# Altium schematic sheet Power.SchDoc: = Title
size 431 x 279 mm; Revision: v1.0; SheetNumber: 2; SheetTotal: 7
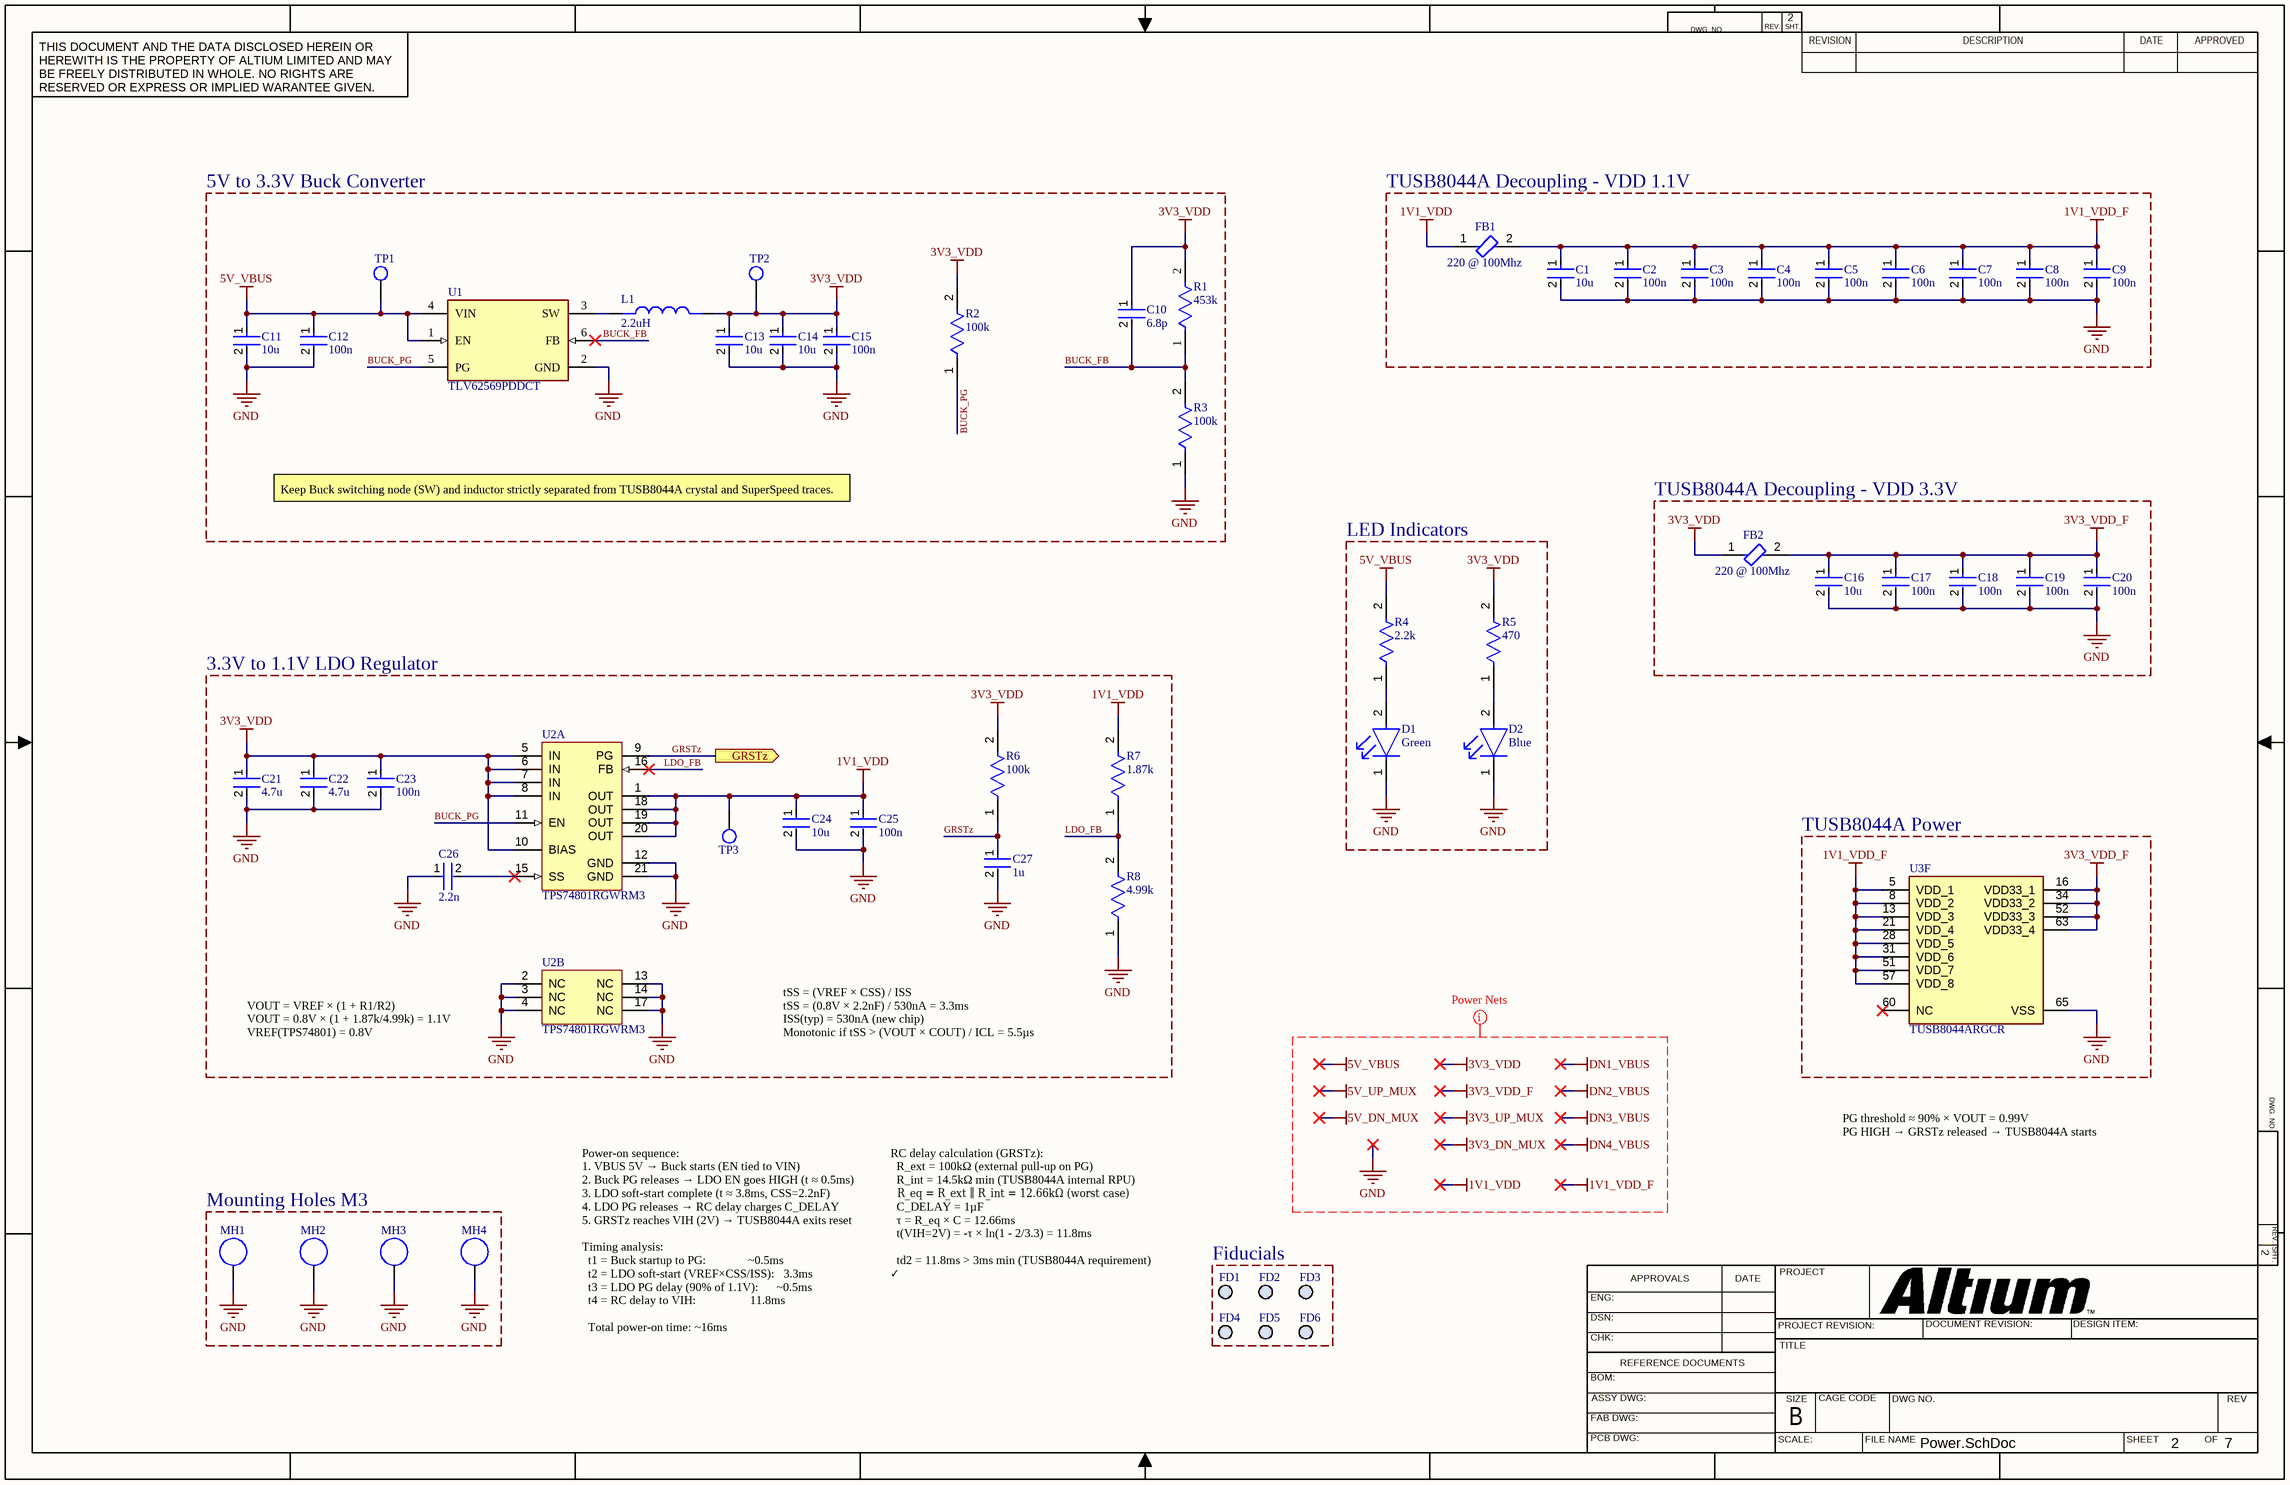
[diagram p0: Power.SchDoc]

## Parts
C1  10u  [FP-GRM21B-0_2-e0_2_0_7-IPC_B]
C2  100n  [FP-GRT155-0_05-IPC_C]
C3  100n  [FP-GRT155-0_05-IPC_C]
C4  100n  [FP-GRT155-0_05-IPC_C]
C5  100n  [FP-GRT155-0_05-IPC_C]
C6  100n  [FP-GRT155-0_05-IPC_C]
C7  100n  [FP-GRT155-0_05-IPC_C]
C8  100n  [FP-GRT155-0_05-IPC_C]
C9  100n  [FP-GRT155-0_05-IPC_C]
C10  6.8p  [FP-GCM155-0_05-IPC_B]
C11  10u  [FP-GRM21B-0_2-e0_2_0_7-IPC_B]
C12  100n  [FP-GRT155-0_05-IPC_C]
C13  10u  [FP-GRM21B-0_2-e0_2_0_7-IPC_B]
C14  10u  [FP-GRM21B-0_2-e0_2_0_7-IPC_B]
C15  100n  [FP-GRT155-0_05-IPC_C]
C16  10u  [FP-GRM21B-0_2-e0_2_0_7-IPC_B]
C17  100n  [FP-GRT155-0_05-IPC_C]
C18  100n  [FP-GRT155-0_05-IPC_C]
C19  100n  [FP-GRT155-0_05-IPC_C]
C20  100n  [FP-GRT155-0_05-IPC_C]
C21  4.7u  [FP-GRM21B-0_2-e0_2_0_7-IPC_A]
C22  4.7u  [FP-GRM21B-0_2-e0_2_0_7-IPC_A]
C23  100n  [FP-GRT155-0_05-IPC_C]
C24  10u  [FP-GRM21B-0_2-e0_2_0_7-IPC_B]
C25  100n  [FP-GRT155-0_05-IPC_C]
C26  2.2n  [FP-AC0402-0_5-MFG]
C27  1u  [FP-GRM155-0_1-IPC_C]
D1  Green  [FP-LTST-C190KGKT-MFG]
D2  Blue  [FP-LTST-C193TBKT-5A-MFG]
FB1  220 @ 100Mhz  [FP-BLM21-0_2-t0_85-e0_5-IPC_B]
FB2  220 @ 100Mhz  [FP-BLM21-0_2-t0_85-e0_5-IPC_B]
FD1  Fiducial_Marker  [Fiducial_Standard]  (value not drawn)  (no BOM)
FD2  Fiducial_Marker  [Fiducial_Standard]  (value not drawn)  (no BOM)
FD3  Fiducial_Marker  [Fiducial_Standard]  (value not drawn)  (no BOM)
FD4  Fiducial_Marker  [Fiducial_Standard]  (value not drawn)  (no BOM)
FD5  Fiducial_Marker  [Fiducial_Standard]  (value not drawn)  (no BOM)
FD6  Fiducial_Marker  [Fiducial_Standard]  (value not drawn)  (no BOM)
L1  2.2uH  [IND_ETQP3M3R3YFP]
MH1  Mounting_Hole_M3  [MH_M3_Stitched]  (value not drawn)  (no BOM)
MH2  Mounting_Hole_M3  [MH_M3_Stitched]  (value not drawn)  (no BOM)
MH3  Mounting_Hole_M3  [MH_M3_Stitched]  (value not drawn)  (no BOM)
MH4  Mounting_Hole_M3  [MH_M3_Stitched]  (value not drawn)  (no BOM)
R1  453k  [FP-ERJ2RK-MFG]
R2  100k  [FP-AC0402-MFG]
R3  100k  [FP-AC0402-MFG]
R4  2.2k  [FP-AC0402-MFG]
R5  470  [FP-AC0402-MFG]
R6  100k  [FP-AC0402-MFG]
R7  1.87k  [FP-AC0402-IPC_A]
R8  4.99k  [FP-AC0402-IPC_A]
TP1  Test_Point  [Test_Point]  (value not drawn)  (no BOM)
TP2  Test_Point  [Test_Point]  (value not drawn)  (no BOM)
TP3  Test_Point  [Test_Point]  (value not drawn)  (no BOM)
U1  TLV62569PDDCT  [FP-DDC0006A-IPC_C]
U2  TPS74801RGWRM3  [TI-RGW20-3150X3150TP_V]  (parts A,B of 2)
U3  TUSB8044ARGCR  [QFN50P900X900X100-65N-D]  (part F of 6)

## Blocks framed on the sheet
5V to 3.3V Buck Converter: C10-C15 L1 R1-R3 TP1 TP2 U1
TUSB8044A Decoupling - VDD 1.1V: C1-C9 FB1
LED Indicators: D1 D2 R4 R5
TUSB8044A Decoupling - VDD 3.3V: C16-C20 FB2
3.3V to 1.1V LDO Regulator: C21-C27 R6-R8 TP3 U2
TUSB8044A Power: U3
Mounting Holes M3: MH1-MH4
Fiducials: FD1-FD6

## Ports
GRSTz (out, see Top_Level[7C], Hub_Core[5D])

## Nets
1V1_VDD: C24.1 C25.1 FB1.1 R7.2 TP3.1 U2.1(OUT) U2.18(OUT) U2.19(OUT) U2.20(OUT)
1V1_VDD_F: C1.1 C2.1 C3.1 C4.1 C5.1 C6.1 C7.1 C8.1 C9.1 FB1.2 U3.5(VDD_1) U3.8(VDD_2) U3.13(VDD_3) U3.21(VDD_4) U3.28(VDD_5) U3.31(VDD_6) U3.51(VDD_7) U3.57(VDD_8)
3V3_VDD: C10.1 C13.1 C14.1 C15.1 C21.1 C22.1 C23.1 FB2.1 L1.2 R1.2 R2.2 R5.2 R6.2 TP2.1 U2.5(IN) U2.6(IN) U2.7(IN) U2.8(IN) U2.10(BIAS)
3V3_VDD_F: C16.1 C17.1 C18.1 C19.1 C20.1 FB2.2 U3.16(VDD33_1) U3.34(VDD33_2) U3.52(VDD33_3) U3.63(VDD33_4)
5V_VBUS: C11.1 C12.1 R4.2 TP1.1 U1.1(EN) U1.4(VIN)
GND: C1.2 C2.2 C3.2 C4.2 C5.2 C6.2 C7.2 C8.2 C9.2 C11.2 C12.2 C13.2 C14.2 C15.2 C16.2 C17.2 C18.2 C19.2 C20.2 C21.2 C22.2 C23.2 C24.2 C25.2 C26.1 C27.2 D1.1(C) D2.1(C) MH1.1 MH2.1 MH3.1 MH4.1 R3.1 R8.1 U1.2(GND) U2.2(NC) U2.3(NC) U2.4(NC) U2.12(GND) U2.13(NC) U2.14(NC) U2.17(NC) U2.21(GND) U3.65(VSS)
BUCK_FB: C10.2 R1.1 R3.2 U1.6(FB)
BUCK_PG: R2.1 U1.5(PG) U2.11(EN)
GRSTz: C27.1 R6.1 U2.9(PG) ; port GRSTz
LDO_FB: R7.1 R8.2 U2.16(FB)
NetC26_2: C26.2 U2.15(SS)
NetD1_2: D1.2(A) R4.1
NetD2_2: D2.2(A) R5.1
NetL1_1: L1.1 U1.3(SW)

Not connected (* = marked no-connect by the designer): U3 60(NC)*

## Layout directives
net class Power_Nets: 1V1_VDD, 1V1_VDD_F, 3V3_DN_MUX, 3V3_UP_MUX, 3V3_VDD, 3V3_VDD_F, 5V_DN_MUX, 5V_UP_MUX, 5V_VBUS, DN1_VBUS, DN2_VBUS, DN3_VBUS, DN4_VBUS, GND

## Notes on the sheet
- Keep Buck switching node (SW) and inductor strictly separated from TUSB8044A crystal and SuperSpeed traces.
- VOUT = VREF × (1 + R1/R2)
  VOUT = 0.8V × (1 + 1.87k/4.99k) = 1.1V
  VREF(TPS74801) = 0.8V
- tSS = (VREF × CSS) / ISS
  tSS = (0.8V × 2.2nF) / 530nA = 3.3ms
  ISS(typ) = 530nA (new chip)
  Monotonic if tSS > (VOUT × COUT) / ICL = 5.5µs
- PG threshold ≈ 90% × VOUT = 0.99V
  PG HIGH → GRSTz released → TUSB8044A starts
- RC delay calculation (GRSTz):
  R_ext = 100kΩ (external pull-up on PG)
  R_int = 14.5kΩ min (TUSB8044A internal RPU)
  R_eq = R_ext ∥ R_int = 12.66kΩ (worst case)
  C_DELAY = 1µF
  τ = R_eq × C = 12.66ms
  t(VIH=2V) = -τ × ln(1 - 2/3.3) = 11.8ms
  td2 = 11.8ms > 3ms min (TUSB8044A requirement) ✓
- Power-on sequence:
  1. VBUS 5V → Buck starts (EN tied to VIN)
  2. Buck PG releases → LDO EN goes HIGH (t ≈ 0.5ms)
  3. LDO soft-start complete (t ≈ 3.8ms, CSS=2.2nF)
  4. LDO PG releases → RC delay charges C_DELAY
  5. GRSTz reaches VIH (2V) → TUSB8044A exits reset
  Timing analysis:
  t1 = Buck startup to PG:              ~0.5ms
  t2 = LDO soft-start (VREF×CSS/ISS):   3.3ms
  t3 = LDO PG delay (90% of 1.1V):      ~0.5ms
  t4 = RC delay to VIH:                  11.8ms
  Total power-on time: ~16ms
- DWG. NO.
- REV.
- SHT.
- THIS DOCUMENT AND THE DATA DISCLOSED HEREIN OR HEREWITH IS THE PROPERTY OF ALTIUM LIMITED AND MAY BE FREELY DISTRIBUTED IN WHOLE. NO RIGHTS ARE RESERVED OR EXPRESS OR IMPLIED WARANTEE GIVEN.
- REVISION
- DESCRIPTION
- DATE
- APPROVED
- ENG:
- APPROVALS
- PROJECT
- DSN:
- CHK:
- REFERENCE DOCUMENTS
- PROJECT REVISION:
- TITLE
- DOCUMENT REVISION:
- DESIGN ITEM:
- BOM:
- FAB DWG:
- PCB DWG:
- ASSY DWG:
- SCALE:
- SIZE
- B
- CAGE CODE
- FILE NAME
- DWG NO.
- SHEET
- OF
- REV

## Library data of the parts
C1 C11 C13 C14 C16 C24 = CMP-06035-047417-1: Chip Multilayer Ceramic Capacitors for General Purpose, 0805, 10uF, X7R, 15%, 10%, 25V
C2-C9 C12 C15 C17-C20 C23 C25 = CMP-06035-030480-1: Multi-Layer Ceramic Capacitor 100nF 50V X7R ±10% 0402 Paper T/R
C10 = CMP-06035-021449-1: Ceramic Capacitor for Automotive 6.8pF ±0.1pF 50VDC C0G 0402 Paper T/R
C21 C22 = CMP-06035-048385-1: Chip Multilayer Ceramic Capacitors for General Purpose, 0805, 4.7uF, X7R, 15%, 10%, 35V
C26 = CMP-03422-000843-1: CAP CER 2200PF 50V X7R 0402; Manufacturer: Yageo; Manufacturer Part Number: AC0402KRX7R9BB222; Value: 2.2 nF; Material: Ceramic; Temperature Coefficient: ±15%; Automotive Grade: Grade 1; Tolerance: 0.1; Temperature: -55°C to +125°C; Automotive: Yes; Device Class L1: Passive Components; Device Class L2: Capacitors; Package: AC0402-0.5; RoHS: TRUE; Temperature Range Low: -55°C; ComponentLink2Description: Datasheet; Category: Cap; Mouser Description: Cap Ceramic 0.0022uF 50V X7R 10% Pad SMD 0402 125C Automotive T/R; Lead Free: Yes; Digikey Description: CAP CER 2200PF 50V X7R 0402; Capacitance: 2.2 nF; Temperature Range High: +125°C; Footprint Url: http://www.yageo.com/exep/pages/download/literatures/UPY-C_GEN_24.pdf; Height: 0.55mm; Temperature Characteristic: X7R; ComponentLink2URL: http://www.yageo.com/documents/recent/UPY-AC_NP0X7R_16V-to-630V_12.pdf; Device Class L3: Ceramic Capacitors; Octopart: https://octopart.com/ac0402krx7r9bb222-yageo-78873070; Ipc Land Pattern Name: CAPC10050X50; Voltage Rating: 50 V
C27 = CMP-06035-028020-1: Chip Multilayer Ceramic Capacitors for General Purpose, 0402, 1.0uF, X7R, 15%, 10%, 10V
D1 = CMP-2000-05197-2: LED GREEN CLEAR CHIP SMD LTST-C193TGKT-5A; Test Current: 20mA; Power Rating: 75mW; Forward Voltage: 2V; Wavelength: 574nm; Number of LEDs: 1; Reverse Voltage: 5V; Dominant Wavelength: 571nm; Lens Style: Diffused; Luminous Intensity: 35mcd; Forward Current: 30mA; Viewing Angle: 130°; Lens Color: Colorless; Width: 0.8mm; Case Code (Imperial): 0603; Case Code (Metric): 1608; Number of Pins: 2; Radiation Hardening: No; Package Quantity: 1; Lead Free: Lead Free; Lens Transparency: Clear; Depth: 0.8mm; Power Dissipation: 75mW; Mount: Surface Mount; Max Operating Temperature: 85°C; Case/Package: 0603; Height: 0.8mm; Illumination Color: Green; Color: Green; Length: 1.6mm; Packaging: Tape and Reel; Number of Elements: 1; Min Operating Temperature: -55°C; Manufacturer Part Number: LTST-C193TGKT-5A
D2 = CMP-2000-06624-2: LED BLUE CLEAR CHIP SMD LTST-C193TBKT-5A; Number of Elements: 1; Forward Voltage: 2.8V; Forward Current: 20mA; Test Current: 5mA; Lens Color: Colorless; Dominant Wavelength: 475nm; Reverse Voltage: 5V; Viewing Angle: 130°; Lens Style: Diffused; Luminous Intensity: 15mcd; Power Dissipation: 76mW; Max Operating Temperature: 80°C; Length: 1.6mm; Number of LEDs: 1; Case/Package: 0603; Case Code (Metric): 1608; Number of Pins: 2; Radiation Hardening: No; Min Operating Temperature: -20°C; Width: 0.8mm; Packaging: Tape and Reel; Package Quantity: 1; Lead Free: Lead Free; Lens Transparency: Clear; Illumination Color: Blue; Color: Blue; RoHS Compliant: Yes; Mount: Surface Mount; Depth: 0.8mm; Case Code (Imperial): 0603; Height: 0.35mm
FB1 FB2 = CMP-0686-00610-3: Chip Ferrite Bead, 0805, 220Ω @ 100MHz, 0.045Ω, 25%, 2A; Number of Circuits: 1; Shielding: Unshielded; DC Resistance (DCR): 45mR; Impedance: 220R; Radiation Hardening: No; Material: Ferrite; Frequency: 100MHz; Width: 1.25mm; DC Current: 2A; Max DC Current: 2A; Number of Lines: 1; Package Quantity: 1; Case Code (Metric): 2012; Current Rating: 2A; Case/Package: 0805; Current: 2A; Military Standard: Not; Core Material: Ferrite; Depth: 1.25mm; Contact Plating: Tin; DC Resistance-Max: 45mR; Max Operating Temperature: 125°C; Length: 2mm; Max Current Rating: 2A; REACH SVHC: No SVHC; Termination: SMD/SMT; Min Operating Temperature: -55°C; Series: BLM21P; Test Frequency: 100MHz; Tolerance: 25%; Number of Pins: 2; RoHS Compliant: Yes; Height: 0.85mm; Packaging: Tape and Reel; Lead Free: Lead Free; Case Code (Imperial): 0805
L1 = ETQP3M3R3YFP: ETQPSeries SMD Wire Wound Choke w/ Metal Core,3.3 uH +/-20% Wire-Wound 8.6A Idc | Panasonic Electronic Components ETQP3M3R3YFP; SnapEDA_Link: https://www.snapeda.com/parts/ETQP3M3R3YFP/Panasonic/view-part/?ref=snap; Package: Package; Value: *; MF: Panasonic; MP: ETQP3M3R3YFP; Check_prices: https://www.snapeda.com/parts/ETQP3M3R3YFP/Panasonic/view-part/?ref=eda
R1 = CMP-2002-00948-2: NexarPartId: 55421189; Power Rating: 100mW; Resistance: 453kΩ; Temperature Coefficient: 100ppm/°C; Tolerance: 1%; Voltage Rating (DC): 50V; Case Code (Metric): 1005; RoHS: Compliant; Length: 1mm; Case Code (Imperial): 0402; Depth: 500µm; Lead Free: Lead Free; Mount: Surface Mount; Termination: SMD/SMT; Schedule B: 8533210045, 8533210045; Max Operating Temperature: 155°C; Max Power Dissipation: 100mW; Width: 508µm; Case/Package: 0402; Military Standard: Not; Number of Terminations: 2; Contact Plating: Tin; Lifecycle Status: Production; Composition: Thick Film; Min Operating Temperature: -55°C; Height: 350µm; Packaging: Cut Tape; Voltage Rating: 50V; REACH SVHC: Yes
R2-R6 = CMP-03412-039042-1: RES 100kΩ ±1% 0.125W 0402
R7 = CMP-03412-017080-2: RES 1.87kΩ ±1% 0.063W 0402; Temperature Coefficient: 100ppm/°C; Resistance: 1.87kR; Max Power Dissipation: 63mW; Features: Moisture Resistant; Width: 0.02inch; Packaging: Tape and Reel; Series: AC; Height: 0.015inch; Min Operating Temperature: -55°C; Number of Terminations: 2; Tolerance: 1%; Length: 0.039inch; Max Operating Temperature: 155°C; Case/Package: 0402; RoHS Compliant: Yes; Resistor Type: Thick Film
R8 = CMP-03412-049531-1: RES 4.99kΩ ±1% 0.125W 0402; RoHS Compliant: Yes
U1 = CMP-04918-000611-1: IC REG BUCK ADJ 2A TSOT23-6; Max Input Voltage: 5.5V; Min Output Voltage: 600mV; Output Configuration: Positive; Output Type: Adjustable; Synchronous Rectifier: Yes; Switching Frequency: 1.5MHz; Min Input Voltage: 2.5V; Case/Package: SOT-23-6; Max Output Voltage: 5.5V; Mount: Surface Mount; Max Operating Temperature: 125°C; Packaging: Cut Tape; Min Operating Temperature: -40°C; Output Current: 2A; RoHS Compliant: Yes
U2 = CMP-0395-01395-1: Single Output LDO, 1.5 A, Adjustable 0.8 to 3.6 V Output, 0.8 to 5.5 V Input, with Programmable Soft Start, 20-pin VQFN (RGW), -40 to 125 degC, Green (RoHS & no Sb/Br); Manufacturer: Texas Instruments; PartNumber: TPS74801RGWTG4; Accuracy(%): 2; Vin(Min)(V): 0.8; SubFamily: Single Channel LDO; Iout(Max)(A): 1.5; Rating: Catalog; Power Good: TRUE; Vout Adj(Max)(V): 3.6; Vdo(Typ)(mV): 60; Vin(Max)(V): 5.5; Iq(Typ)(mA): 1; PackageReference: RGW20-3150X3150TP; ComponentLink2Description: Datasheet; PackageDescription: 20-Pin Plastic Quad Flat No-Pin, 5 x 5 mm Body, 0.65 mm Pitch, 3.15 x 3.15 mm Exposed Pad; ComponentLink1URL: http://www.ti.com/; DatasheetVersion: SBVS074J; Mounting Technology: Surface Mount; ComponentLink3Description: Package Specification; Vout Adj(Min)(V): 0.8; Code_JEDEC: MO-220; ComponentLink3URL: http://www.ti.com/litv/pdf/mpqf122b; Eco-Plan: Green (RoHS & no Sb/Br); ComponentLink4Description: URL Link1; ComponentLink4URL: Samples URL:http://www.ti.com/product/tps74801#samples; ComponentLink2URL: http://www.ti.com/general/docs/lit/getliterature.tsp?genericPartNumber=TPS74801&fileType=pdf; ComponentLink1Description: Manufacturer URL
U3 = TUSB8044ARGCR: Four-port USB 3.2 x1 Gen1 hub with USB billboard; Manufacturer_Name: Texas Instruments; Geometry.Height: 1mm; Mouser Part Number: 595-TUSB8044ARGCR; Mouser Price/Stock: https://www.mouser.co.uk/ProductDetail/Texas-Instruments/TUSB8044ARGCR?qs=9r4v7xj2LnlTBCFutY1Bfg%3D%3D; Manufacturer_Part_Number: TUSB8044ARGCR; Datasheet Link: http://www.ti.com/lit/gpn/TUSB8044A